# Altium schematic sheet Usb.SchDoc
size A3; SheetNumber: 3; SheetTotal: 4
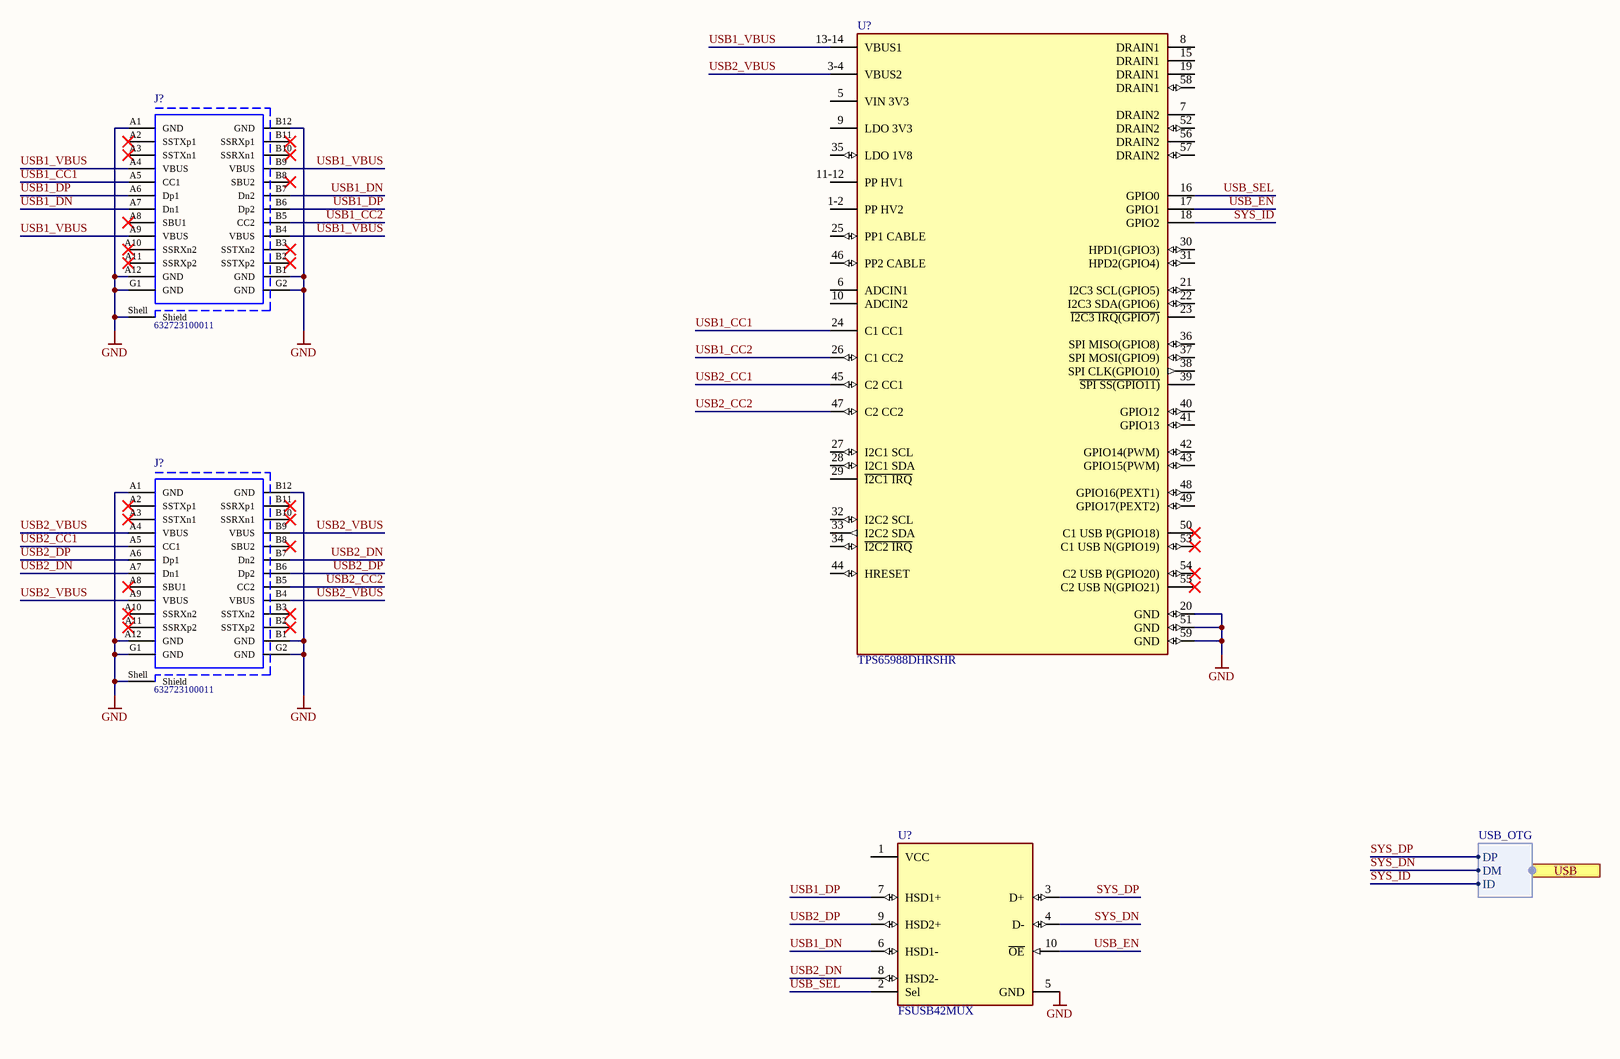
[diagram p0: Usb.SchDoc]

## Parts
(Parts that share a designator on the sheet are numbered #1, #2 ... from top to bottom, then left to right.)
J?#1  632723100011  [632723100011]
J?#2  632723100011  [632723100011]
U?#1  TPS65988DHRSHR  [FP-RSH0056E-MFG]
U?#2  FSUSB42MUX  [FP-846AP-MFG]

## Ports
USB (harness USB_OTG)

## Harnesses
USB_OTG: DP, DM, ID

## Nets
GND: J?#1.A1(GND) J?#1.A12(GND) J?#1.B1(GND) J?#1.B12(GND) J?#1.G1(GND) J?#1.G2(GND) J?#1.Shell(Shield) J?#2.A1(GND) J?#2.A12(GND) J?#2.B1(GND) J?#2.B12(GND) J?#2.G1(GND) J?#2.G2(GND) J?#2.Shell(Shield) U?#1.20(GND) U?#1.51(GND) U?#1.59(GND) U?#2.5(GND)
SYS_DN: U?#2.4(D-) ; port USB.DM
SYS_DP: U?#2.3(D+) ; port USB.DP
SYS_ID: U?#1.18(GPIO2) ; port USB.ID
USB1_CC1: J?#1.A5(CC1) U?#1.24(C1_CC1)
USB1_CC2: J?#1.B5(CC2) U?#1.26(C1_CC2)
USB1_DN: J?#1.A7(Dn1) J?#1.B7(Dn2) U?#2.6(HSD1-)
USB1_DP: J?#1.A6(Dp1) J?#1.B6(Dp2) U?#2.7(HSD1+)
USB1_VBUS: J?#1.A4(VBUS) J?#1.A9(VBUS) J?#1.B4(VBUS) J?#1.B9(VBUS) U?#1.13-14(VBUS1)
USB2_CC1: J?#2.A5(CC1) U?#1.45(C2_CC1)
USB2_CC2: J?#2.B5(CC2) U?#1.47(C2_CC2)
USB2_DN: J?#2.A7(Dn1) J?#2.B7(Dn2) U?#2.8(HSD2-)
USB2_DP: J?#2.A6(Dp1) J?#2.B6(Dp2) U?#2.9(HSD2+)
USB2_VBUS: J?#2.A4(VBUS) J?#2.A9(VBUS) J?#2.B4(VBUS) J?#2.B9(VBUS) U?#1.3-4(VBUS2)
USB_EN: U?#1.17(GPIO1) U?#2.10(~{OE})
USB_SEL: U?#1.16(GPIO0) U?#2.2(Sel)

Not connected (* = marked no-connect by the designer): J?#1 A2(SSTXp1)* A3(SSTXn1)* A8(SBU1)* A10(SSRXn2)* A11(SSRXp2)* B2(SSTXp2)* B3(SSTXn2)* B8(SBU2)* B10(SSRXn1)* B11(SSRXp1)*; J?#2 A2(SSTXp1)* A3(SSTXn1)* A8(SBU1)* A10(SSRXn2)* A11(SSRXp2)* B2(SSTXp2)* B3(SSTXn2)* B8(SBU2)* B10(SSRXn1)* B11(SSRXp1)*; U?#1 1-2(PP_HV2) 5(VIN_3V3) 6(ADCIN1) 7(DRAIN2) 8(DRAIN1) 9(LDO_3V3) 10(ADCIN2) 11-12(PP_HV1) 15(DRAIN1) 19(DRAIN1) 21(I2C3_SCL(GPIO5)) 22(I2C3_SDA(GPIO6)) 23(~{I2C3_IRQ(GPIO7)}) 25(PP1_CABLE) 27(I2C1_SCL) 28(I2C1_SDA) 29(~{I2C1_IRQ}) 30(HPD1(GPIO3)) 31(HPD2(GPIO4)) 32(I2C2_SCL) 33(I2C2_SDA) 34(~{I2C2_IRQ}) 35(LDO_1V8) 36(SPI_MISO(GPIO8)) 37(SPI_MOSI(GPIO9)) 38(SPI_CLK(GPIO10)) 39(~{SPI_SS(GPIO11)}) 40(GPIO12) 41(GPIO13) 42(GPIO14(PWM)) 43(GPIO15(PWM)) 44(HRESET) 46(PP2_CABLE) 48(GPIO16(PEXT1)) 49(GPIO17(PEXT2)) 50(C1_USB_P(GPIO18))* 52(DRAIN2) 53(C1_USB_N(GPIO19))* 54(C2_USB_P(GPIO20))* 55(C2_USB_N(GPIO21))* 56(DRAIN2) 57(DRAIN2) 58(DRAIN1); U?#2 1(VCC)

## Library data of the parts
J?#1 J?#2 = CMP-1502-03213-1: USB 3.1 Type C Receptacle WR-COM, Horizontal, SMT / THT; Manufacturer: Wurth Elektronik; Working Voltage: 20VDC; Rated Current: 5A; Contact Resistance: 30mOhm; Operating Temperature: -40to105degC; Publisher: WurthElektronik; Gender: Receptacle; Part Number: 632723100011; Mounting Technology: SMT/THT; Datasheet URL: https://katalog.we-online.de/em/datasheet/632723x00011%282%29.pdf; Connector Type: USB3.1TypeC; Manufacturer URL: http://www.we-online.de; Orientation: Horizontal; Package Reference: 632723100011; Packaging: TapeandReel
U?#1 = CMP-04877-000032-1: ACELITE 88 ROM 1.6 PROTO 7X7; Operating Supply Current: 45uA; RoHS Compliant: Yes; Packaging: Cut Tape; Max Operating Temperature: 85°C; Case/Package: VQFN; Min Operating Temperature: -40°C; Mount: Surface Mount
U?#2 = CMP-07103-000004-1: IC USB SWITCH DPDT 10MSOP; Voltage: 4.3V; Current: 100mA; Number of Inputs: 2; Supply Type: Single; Number of Outputs: 4; Data Rate: 480Mbps; On-State Resistance: 6.5R; Min Supply Voltage: 3V; Package Quantity: 1; Length: 3mm; Radiation Hardening: No; Number of Pins: 10; Width: 3mm; Number of Channels: 2; REACH SVHC: No SVHC; Lead Free: Lead Free; Max Operating Temperature: 85°C; Min Operating Temperature: -40°C; Packaging: Tape and Reel; Throw Configuration: DPDT; Operating Supply Voltage: 4.3V; Max Supply Voltage: 4.3V; Mount: Surface Mount; Case/Package: MSOP; Weight: 0.1125g; Height: 0.85mm